# Altium schematic sheet ALU_OR.SchDoc
size A; Author: E. Sims; Organization: Let's Build Rockets Inc.; SheetNumber: 3; SheetTotal: 7
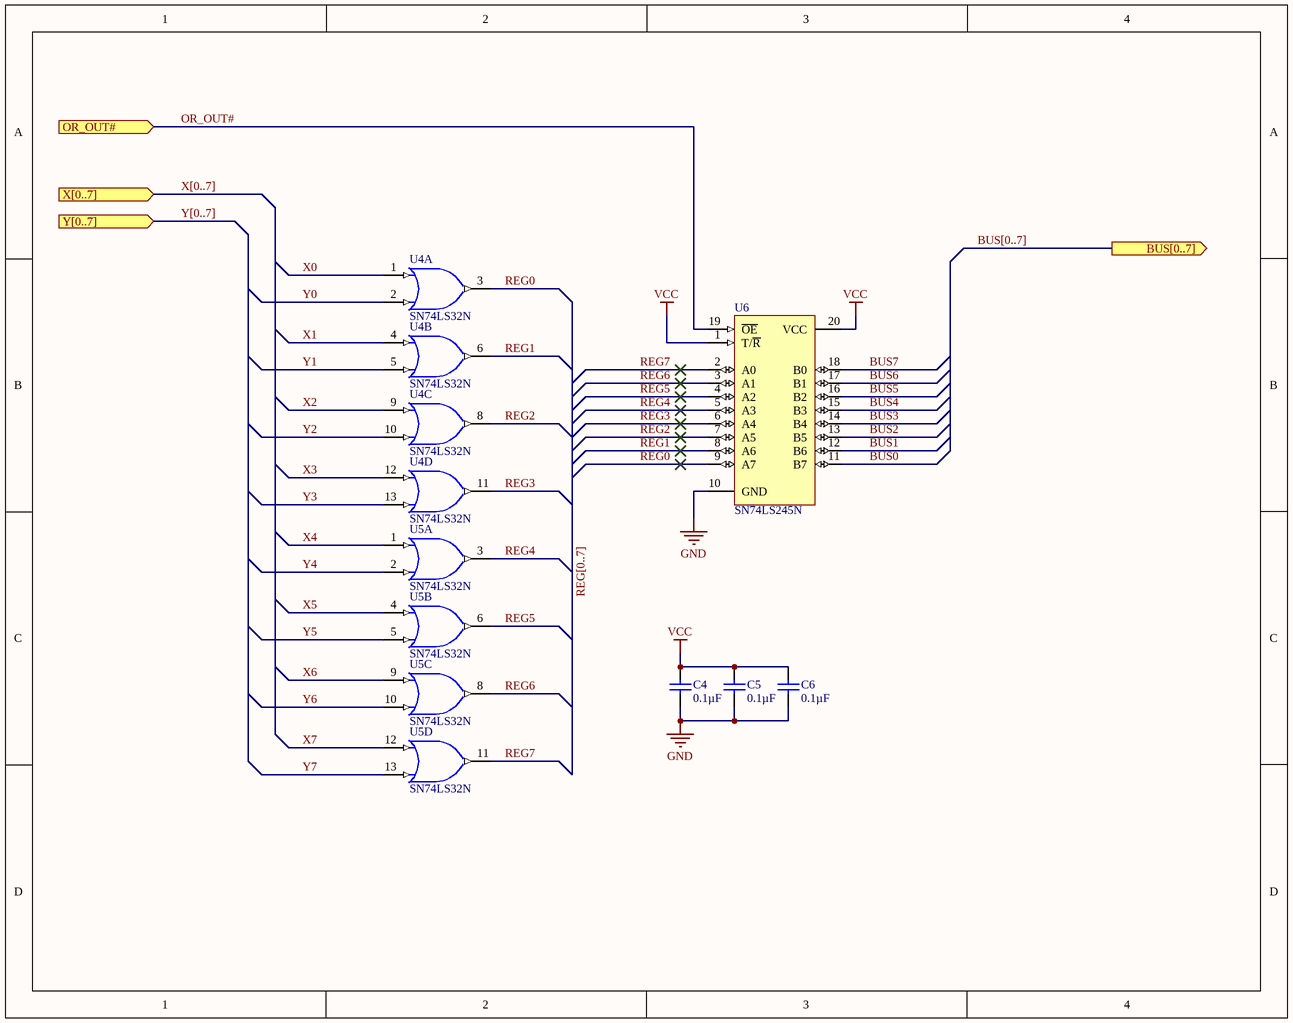
[diagram p0: ALU_OR.SchDoc]

## Parts
C4  Capacitance: 0.1µF  [VISH-K104K15X7RF5TL2]  (hidden comment: K104K15X7RF5TL2)
C5  Capacitance: 0.1µF  [VISH-K104K15X7RF5TL2]  (hidden comment: K104K15X7RF5TL2)
C6  Capacitance: 0.1µF  [VISH-K104K15X7RF5TL2]  (hidden comment: K104K15X7RF5TL2)
U4  SN74LS32N  [N014]  (parts A,B,C,D of 4)
U5  SN74LS32N  [N014]  (parts A,B,C,D of 4)
U6  SN74LS245N  [N020]

## Ports
BUS[0..7] (out), OR_OUT# (in), X[0..7] (in), Y[0..7] (in)

## Nets
GND: C4.2 C5.2 C6.2 U4.7(GND) U5.7(GND) U6.10(GND)
VCC: C4.1 C5.1 C6.1 U4.14(VCC) U5.14(VCC) U6.1(T/~{R}) U6.20(VCC)
BUS0: U6.11(B7)
BUS1: U6.12(B6)
BUS2: U6.13(B5)
BUS3: U6.14(B4)
BUS4: U6.15(B3)
BUS5: U6.16(B2)
BUS6: U6.17(B1)
BUS7: U6.18(B0)
OR_OUT#: U6.19(~{OE}) ; port OR_OUT#
REG0: U4.3(Y) U6.9(A7)
REG1: U4.6(Y) U6.8(A6)
REG2: U4.8(Y) U6.7(A5)
REG3: U4.11(Y) U6.6(A4)
REG4: U5.3(Y) U6.5(A3)
REG5: U5.6(Y) U6.4(A2)
REG6: U5.8(Y) U6.3(A1)
REG7: U5.11(Y) U6.2(A0)
X0: U4.1(A)
X1: U4.4(A)
X2: U4.9(A)
X3: U4.12(A)
X4: U5.1(A)
X5: U5.4(A)
X6: U5.9(A)
X7: U5.12(A)
Y0: U4.2(B)
Y1: U4.5(B)
Y2: U4.10(B)
Y3: U4.13(B)
Y4: U5.2(B)
Y5: U5.5(B)
Y6: U5.10(B)
Y7: U5.13(B)

## Buses and harness runs
bus BUS[0..7] = port BUS[0..7]
bus REG[0..7]
bus X[0..7] = port X[0..7]
bus Y[0..7] = port Y[0..7]

## Notes on the sheet
- Let's Build Rocket's Inc. Modular Paylaod System Based on TMP-010 Rev
  For more information visit https://github.com/LetsBuildRockets/Modular-Payload-System
  This work is licensed under CC BY-NC 4.0. To view a copy of this license, visit https://creativecommons.org/licenses/by-nc/4.0
- Title
- Size:
- Date:
- Assembly Variant:
- B
- Number:
- Time:
- Revision:
- Sheet
- of
- Author:
- File:

## Library data of the parts
C4-C6 = CMP-2000-06508-1: Ceramic Capacitor, 100 nF, +/- 10%, 50 V, -55 to 125 degC, 2-Pin THD, RoHS, Tape and Reel; Manufacturer: Vishay; Other Names: BC1084CT; Catalog Drawings: Mono-KapSide2-15_5.58Mono-KapSide1_15; Temperature Coefficient: X7R; Voltage - Rated: 50V; Online Catalog: Mono-Kap™Series; Size / Dimension: 0.157"Lx0.098"W(4.00mmx2.50mm); Operating Temperature: -55°C~125°C; Family: CeramicCapacitors; Manufacturer URL: http://www.vishay.com/; Standard Package: 1; Thickness (Max): -; Ratings: -; Datasheet Version: 08/2013; Package Description: 2-Pin Through Hole Device, Body 4 x 2.6 mm; Mounting Type: ThroughHole; Features: -; Lead Spacing: 0.098"(2.50mm); Tolerance: ±10%; Category: Capacitors; Mounting Technology: ThroughHole; Lead Style: Straight; Datasheet URL: http://www.vishay.com/docs/45171/kseries.pdf; Applications: GeneralPurpose; Package / Case: Radial; Height - Seated (Max): 0.220"(5.58mm); Package Reference: K104K15X7RF5TL2; Series: Mono-Kap™K; Packaging: CutTape(CT)
U4 U5 = SN74LS32N: Quadruple 2-Input Positive-OR Gate; Published: 8-Jun-2000; LatestRevisionDate: 04-Mar-2005; LatestRevisionNote: Stylized 3D Model Added.; DatasheetVersion: Mar-1988; PackageVersion: Oct-1995; PackageReference: N014; Publisher: Altium Limited; PackageDescription: DIP; 14 Leads; Row Spacing 7.62 mm; Pitch 2.54 mm; ComponentLink1Description: Manufacturer Link; ComponentLink1URL: http://www.ti.com/; ComponentLink2Description: Datasheet; ComponentLink2URL: http://www-s.ti.com/sc/ds/sn74ls32.pdf
U6 = SN74LS245N: Octal Bus Transceiver with 3-State Outputs; Published: 8-Jun-2000; LatestRevisionDate: 04-Mar-2005; LatestRevisionNote: Stylized 3D Model Added.; DatasheetVersion: Mar-1988; PackageVersion: Oct-1995; PackageReference: N020; Publisher: Altium Limited; PackageDescription: DIP; 20 Leads; Row Spacing 7.62 mm; Pitch 2.54 mm; ComponentLink1Description: Manufacturer Link; ComponentLink1URL: http://www.ti.com/; ComponentLink2Description: Datasheet; ComponentLink2URL: http://www-s.ti.com/sc/ds/sn74ls245.pdf